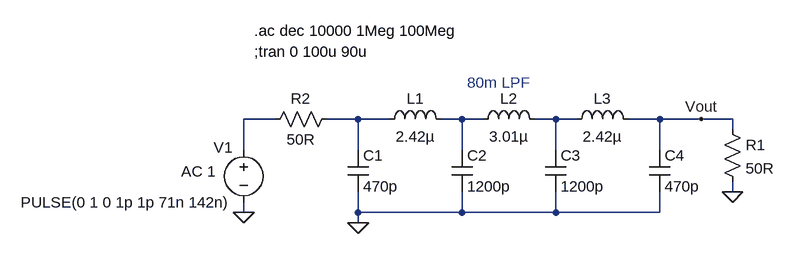
[diagram p0: schematic 80m QRPLabs LPF.asc]
80m QRPLabs LPF.asc, the LTspice schematic file:
Version 4
SHEET 1 880 680
WIRE -160 112 -208 112
WIRE -32 112 -80 112
WIRE 16 112 -32 112
WIRE 128 112 96 112
WIRE 160 112 128 112
WIRE 272 112 240 112
WIRE 304 112 272 112
WIRE 432 112 384 112
WIRE 496 112 432 112
WIRE 544 112 496 112
WIRE 544 128 544 112
WIRE -208 160 -208 112
WIRE -32 160 -32 112
WIRE 128 160 128 112
WIRE 272 160 272 112
WIRE 432 160 432 112
WIRE 544 224 544 208
WIRE -208 256 -208 240
WIRE -32 256 -32 224
WIRE 128 256 128 224
WIRE 128 256 -32 256
WIRE 272 256 272 224
WIRE 272 256 128 256
WIRE 432 256 432 224
WIRE 432 256 272 256
WIRE -32 272 -32 256
FLAG -208 256 0
FLAG 544 224 0
FLAG 496 112 Vout
FLAG -32 272 0
SYMBOL voltage -208 144 R0
WINDOW 123 -96 49 Left 2
WINDOW 39 0 0 Left 2
WINDOW 0 -46 12 Left 2
WINDOW 3 -343 96 Left 2
SYMATTR Value2 AC 1
SYMATTR InstName V1
SYMATTR Value PULSE(0 1 0 1p 1p 71n 142n)
SYMBOL res 528 112 R0
SYMATTR InstName R1
SYMATTR Value 50R
SYMBOL res -64 96 R90
WINDOW 0 0 56 VBottom 2
WINDOW 3 32 56 VTop 2
SYMATTR InstName R2
SYMATTR Value 50R
SYMBOL ind 0 128 R270
WINDOW 0 32 56 VTop 2
WINDOW 3 5 56 VBottom 2
SYMATTR InstName L1
SYMATTR Value 2.42µ
SYMBOL ind 144 128 R270
WINDOW 0 32 56 VTop 2
WINDOW 3 5 56 VBottom 2
SYMATTR InstName L2
SYMATTR Value 3.01µ
SYMBOL ind 288 128 R270
WINDOW 0 32 56 VTop 2
WINDOW 3 5 56 VBottom 2
SYMATTR InstName L3
SYMATTR Value 2.42µ
SYMBOL cap -48 160 R0
SYMATTR InstName C1
SYMATTR Value 470p
SYMBOL cap 112 160 R0
SYMATTR InstName C2
SYMATTR Value 1200p
SYMBOL cap 256 160 R0
SYMATTR InstName C3
SYMATTR Value 1200p
SYMBOL cap 416 160 R0
SYMATTR InstName C4
SYMATTR Value 470p
TEXT -192 8 Left 2 !;tran 0 100u 90u
TEXT -192 -24 Left 2 !.ac dec 10000 1Meg 100Meg
TEXT 136 56 Left 2 ;80m LPF

The netlist it stands for:
* 80m QRPLabs LPF.asc
V1 N001 0 PULSE(0 1 0 1p 1p 71n 142n) AC 1
R1 Vout 0 50R
R2 N002 N001 50R
L1 N002 N003 2.42µ
L2 N003 N004 3.01µ
L3 N004 Vout 2.42µ
C1 N002 0 470p
C2 N003 0 1200p
C3 N004 0 1200p
C4 Vout 0 470p
;tran 0 100u 90u
.ac dec 10000 1Meg 100Meg
* 80m LPF
.backanno
.end